# EasyEDA Pro project ProDoc_ATM触摸屏方案_2026-06-23.epro

# Schematic Schematic15
Board Name: Board1; Create Date: 2026-01-06; Page Name: P1; Project Name: 电容计量1; Schematic Name: Schematic5; Update Date: 2026-01-06; Page Size: A4; Version: V1.0
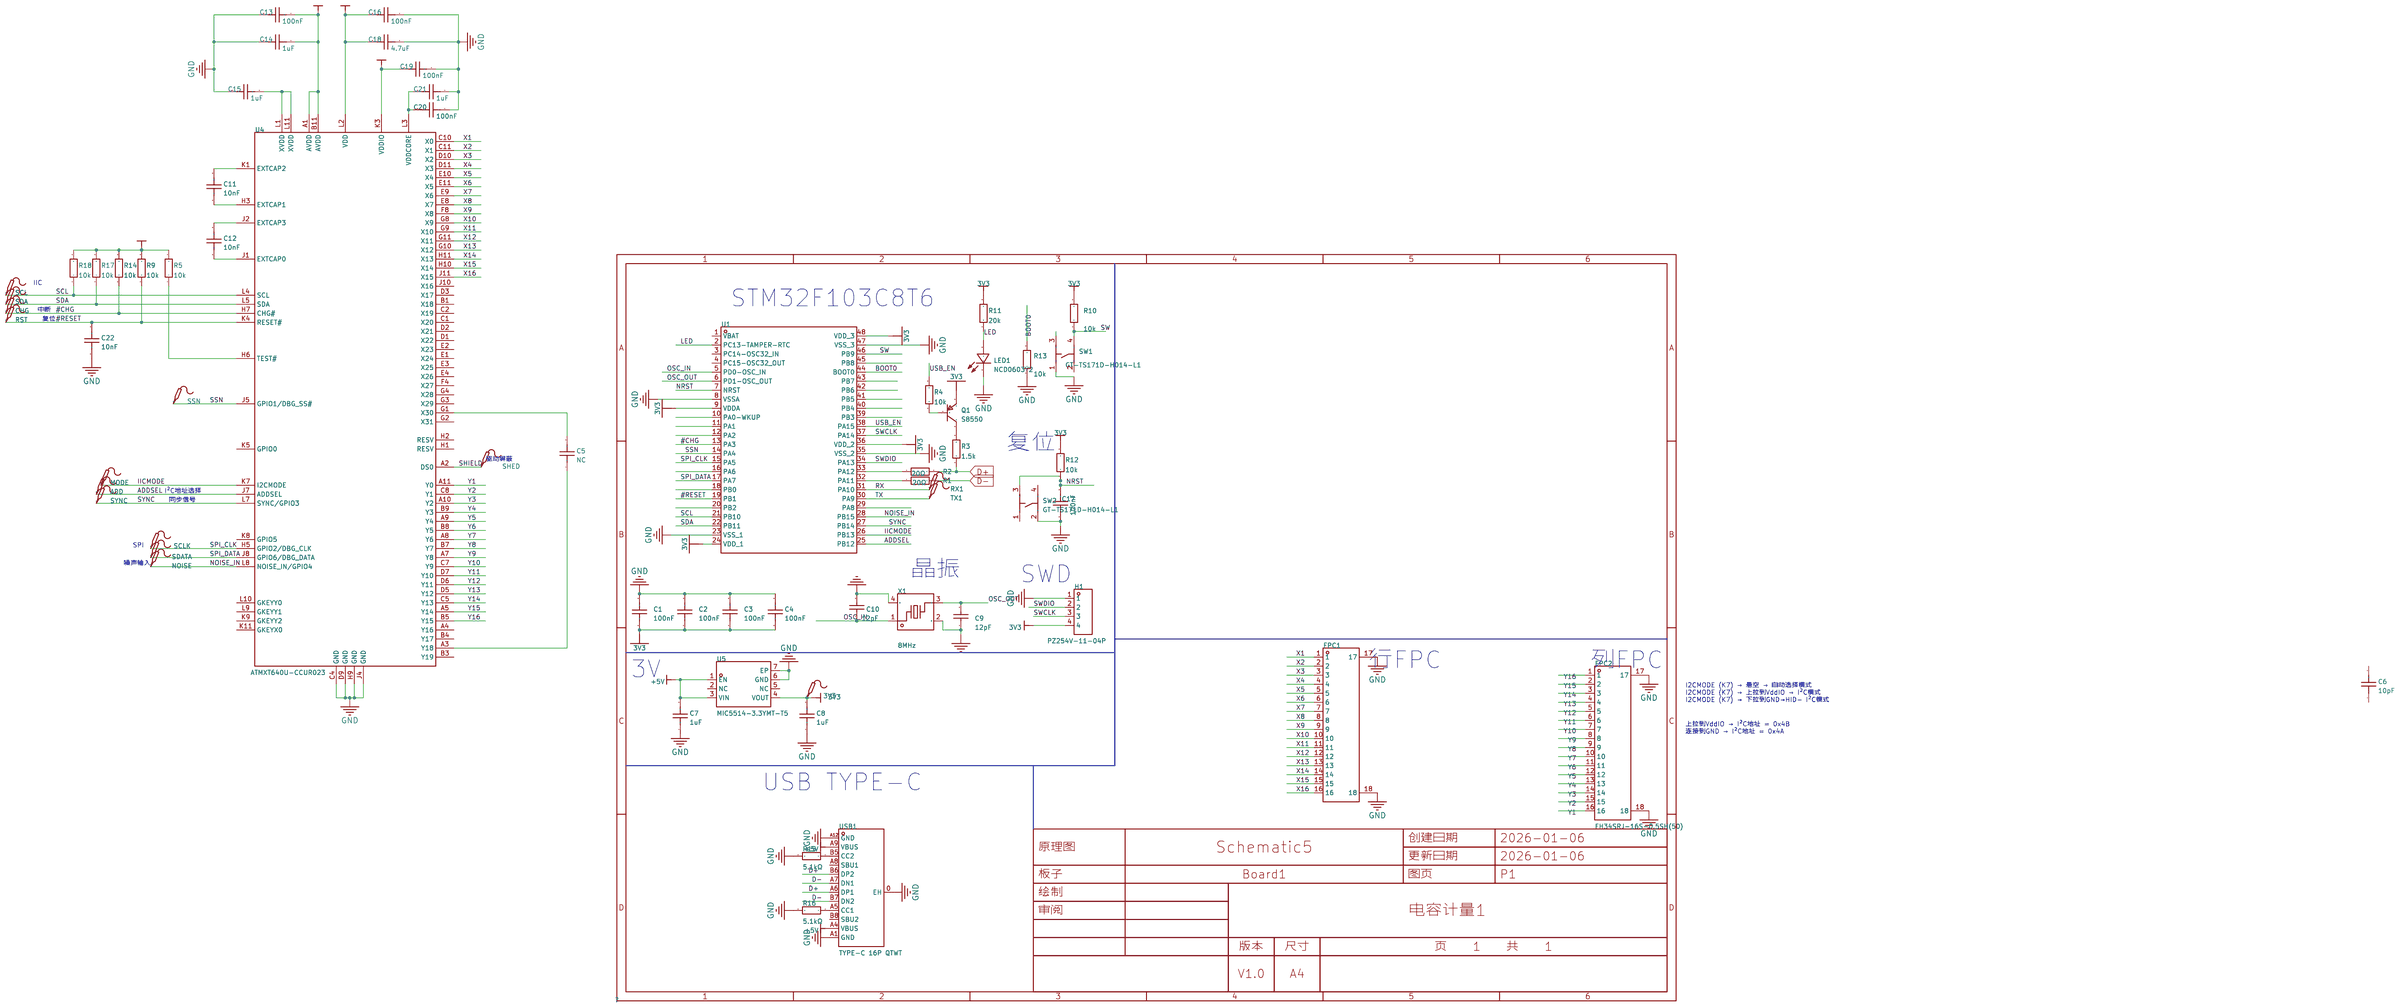
[diagram p0: schematic sheet]

## Parts
3V3  -  [Test-Point-0.5mm]
ADD  -  [Test-Point-0.5mm]
C1  100nF  [C0402]
C2  100nF  [C0402]
C3  100nF  [C0402]
C4  100nF  [C0402]
C5  NC  [C0402]
C6  10pF  [C0402]
C7  1uF  [C0402]
C8  1uF  [C0402]
C9  12pF  [C0402]
C10  12pF  [C0402]
C11  10nF  [C0402]
C12  10nF  [C0402]
C13  100nF  [C0402]
C14  1uF  [C0402]
C15  1uF  [C0402]
C16  100nF  [C0402]
C17  100nF  [C0402]
C18  4.7uF  [C0402]
C19  100nF  [C0402]
C20  100nF  [C0402]
C21  1uF  [C0402]
C22  10nF  [C0402]
CHG  -  [Test-Point-0.5mm]
FPC1  FH34SRJ-16S-0.5SH(50)  [FFC-SMD_16P-P0.50_FH34SRJ-16S-0.5SH]
FPC2  FH34SRJ-16S-0.5SH(50)  [FFC-SMD_16P-P0.50_FH34SRJ-16S-0.5SH]
H1  PZ254V-11-04P  [HDR-TH_4P-P2.54-V-M]
LED1  NCD0603Y2  [LED0603-RD]
MODE  -  [Test-Point-0.5mm]
NOISE  -  [Test-Point-0.5mm]
Q1  S8550  [SOT-23-3_L2.9-W1.3-P1.90-LS2.4-BR]
R1  20Ω  [R0402]
R2  20Ω  [R0402]
R3  1.5k  [R0402]
R4  10k  [R0402]
R5  10k  [R0402]
R9  10k  [R0402]
R10  10k  [R0402]
R11  20k  [R0402]
R12  10k  [R0402]
R13  10k  [R0402]
R14  10k  [R0402]
R15  5.1kΩ  [R0402]
R16  5.1kΩ  [R0402]
R17  10k  [R0402]
R18  10k  [R0402]
RST  -  [Test-Point-0.5mm]
RX1  -  [Test-Point-0.5mm]
SCL  -  [Test-Point-0.5mm]
SCLK  -  [Test-Point-0.5mm]
SDA  -  [Test-Point-0.5mm]
SDATA  -  [Test-Point-0.5mm]
SHED  -  [Test-Point-0.5mm]
SSN  -  [Test-Point-0.5mm]
SW1  GT-TS171D-H014-L1  [SW-SMD_4P-L3.0-W2.8-P1.65-TL_GT-TS171A-H014-L1]
SW2  GT-TS171D-H014-L1  [SW-SMD_4P-L3.0-W2.8-P1.65-TL_GT-TS171A-H014-L1]
SYNC  -  [Test-Point-0.5mm]
TX1  -  [Test-Point-0.5mm]
U1  -  [LQFP-48_L7.0-W7.0-P0.50-LS9.0-BL]
U4  ATMXT640U-CCUR023  [UFBGA-88_L6.0-W6.0-P0.50-TL_MICROCHIP_ATMXT640UXXX]
U5  MIC5514-3.3YMT-T5  [DFN-6_L1.6-W1.6-P0.50-BL-EP]
USB1  TYPE-C 16P QTWT  [USB-TYPE-C-SMD_TYPE-C-16P-QTWT]
X1  8MHz  [CRYSTAL-SMD_4P-L3.2-W2.5-BL-1]

## Library data of the parts
3V3 ADD CHG MODE NOISE RST RX1 SCL SCLK SDA SDATA SHED SSN SYNC TX1 = Test-Point: Test Point 测试点
C1-C8 C11-C16 C18-C22 = CC0402KRX7R7BB104: 容值:100nF;精度:±10%;额定电压:16V;温度系数:X7R;; LCSC Part Name: 100nF ±10% 16V; Supplier Part: C60474; Manufacturer: YAGEO(国巨); Supplier Footprint: 0402; JLCPCB Part Class: Extended Part; Datasheet: https://atta.szlcsc.com/upload/public/pdf/source/20211223/9278FD768280B81DDBEF48FA36411A03.pdf; Supplier: LCSC; Tolerance: ±10%; Voltage Rated: 16V; Temperature Coefficient: X7R
C9 C10 = GCM1555C1H120FA16D: 容值:12pF;精度:±1%;额定电压:50V;材质(温度系数):C0G;; LCSC Part Name: 12pF ±1% 50V; Supplier Part: C393682; Manufacturer: muRata(村田); Supplier Footprint: 0402; JLCPCB Part Class: Extended Part; Datasheet: https://atta.szlcsc.com/upload/public/pdf/source/20190516/C393682_2405B7553F1D74F0F214F12B2CF6E34B.pdf; Supplier: LCSC; Tolerance: ±1%; Voltage Rated: 50V; Temperature Coefficient: C0G
C17 = CC0603KRX7R9BB104: 容值:100nF;精度:±10%;额定电压:50V;材质(温度系数):X7R;; LCSC Part Name: 100nF ±10% 50V; Supplier Part: C14663; Manufacturer: YAGEO(国巨); Supplier Footprint: 0603; JLCPCB Part Class: Basic Part; Datasheet: https://atta.szlcsc.com/upload/public/pdf/source/20170116/1484561234239.pdf; Supplier: LCSC; Tolerance: ±10%; Voltage Rated: 50V; Temperature Coefficient: X7R
FPC1 FPC2 = FH34SRJ-16S-0.5SH(50): 锁定特性:-;触点类型:双侧触点/上下接;触点数量:16P;间距:0.5mm;安装方式:卧贴;工作温度:-55℃~+105℃;; LCSC Part Name: 间距:0.5mm P数:16P 双侧触点/上下接; Supplier Part: C324725; Manufacturer: HRS(广濑); Supplier Footprint: SMD,P=0.5mm,卧贴; JLCPCB Part Class: 扩展库; Datasheet: https://item.szlcsc.com/datasheet/FH34SRJ-16S-0.5SH(50)/305535.html; Supplier: LCSC; Contact Type: 双侧触点/上下接; Number of Contacts: 16P; Pitch: 0.5mm; Mounting Type: 卧贴; FFC, FCB Thickness: 0.3mm; Height Above Board: 1mm; Contact Material: 磷青铜; Contact Plating: 金; Operating Temperature: -55℃~+105℃
H1 = PZ254V-11-04P: 插针结构:1x4P;间距:2.54mm;行距:-;圆针/方针:方针;安装方式:直插;排数:单排;总PIN位数:4P;额定电流:3A;额定电压:250V;配合针长度:6mm;塑高:2.5mm;端接针长度:3mm;触头材质:-;工作温度:-40℃~+105℃;颜色:黑色;; LCSC Part Name: 1x4P 间距:2.54mm 方针 直插; Supplier Part: C2691448; Manufacturer: XFCN(兴飞); Supplier Footprint: 插件,P=2.54mm; JLCPCB Part Class: 扩展库; Datasheet: https://item.szlcsc.com/datasheet/PZ254V-11-04P/2801085.html; Supplier: LCSC; Pin Structure: 1x4P; Pitch: 2.54mm; Circluar Pins/Square Pins: 方针; Mounting Type: 直插; Number of Rows: 单排; Number of Pins: 4P; Current Rating: 3A; Voltage Rating (Max): 250V; Length of Mating Pin: 6mm; Insulation Height: 2.5mm; Length of End Connection Pin: 3mm; Operating Temperature: -40℃~+105℃; Color: 黑色
LED1 = NCD0603Y2: 发光颜色:黄色;正向电压(VF):1.6V~2.6V;功率:65mW;正向电流:20mA;主波长:586nm~595nm;透镜颜色:无色透明透镜;发光强度:100mcd~220mcd;发光角度:130°;工作温度:-30℃~+85℃;; Supplier Part: C89811; Manufacturer: 国星光电; Supplier Footprint: 0603; JLCPCB Part Class: Extended Part; Datasheet: https://atta.szlcsc.com/upload/public/pdf/source/20200820/C89811_7FE84B429B6BCA3E113B125EE1452576.pdf; Supplier: LCSC; Emitted Color: 黄色; Forward Voltage (VF): 1.6V~2.6V; Power Dissipation: 65mW; Forward Current: 20mA; Dominant Wavelength: 586nm~595nm; Lens Color: 无色透明透镜; Luminous Intensity: 100mcd~220mcd; Viewing Angle: 130°; Operating Temperature: -30℃~+85℃
Q1 = S8550: LCSC Part Name: PNP -25V -500mA 120-400 SOT-23; Supplier Part: C2931720; Manufacturer: Doeshare(德芯); Supplier Footprint: SOT-23; JLCPCB Part Class: 扩展库; Datasheet: https://atta.szlcsc.com/upload/public/pdf/source/20220104/15A23F6542E365B9E2BA018BE45092B6.pdf; Supplier: LCSC
R1 R2 = 0402WGJ0102TCE: 电阻类型:厚膜电阻;阻值:1kΩ;精度:±5%;功率:1/16W;温度系数:±100ppm/℃;最大工作电压:50V;工作温度范围:-55℃~+155℃;; LCSC Part Name: 1kΩ ±5%; Supplier Part: C25543; Manufacturer: UNI-ROYAL(厚声); Supplier Footprint: 0402; JLCPCB Part Class: Extended Part; Datasheet: https://atta.szlcsc.com/upload/public/pdf/source/20200306/C422600_1E6D84923E4A46A82E41ADD87F860B5C.pdf; Supplier: LCSC; Type: 厚膜电阻; Tolerance: ±5%; Power(Watts): 1/16W; Temperature Coefficient: ±100ppm/℃; Overload Voltage (Max): 50V; Operating Temperature Range: -55℃~+155℃
R3-R5 R9-R14 R17 R18 = 0603WAF1002T5E: LCSC Part Name: 10KΩ(1002) ±1% 编带; Supplier Part: C25804; Manufacturer: UNI-ROYAL(厚声); Supplier Footprint: 0603; JLCPCB Part Class: Basic Part; Datasheet: https://atta.szlcsc.com/upload/public/pdf/source/20170920/C25804_1505901551523983377.pdf; Supplier: LCSC
R15 R16 = 0805W8F5101T5E: 精度:±1%;温度系数:±100ppm/;阻值:5.1kΩ;功率:1/8W;最大工作电压:150V;工作温度范围:-55~+155;; LCSC Part Name: 5.1kΩ ±1%; Supplier Part: C27834; Manufacturer: UNI-ROYAL(厚声); Supplier Footprint: 0805; JLCPCB Part Class: 基础库; Datasheet: https://atta.szlcsc.com/upload/public/pdf/source/20170920/C27834_1505895234018981184.pdf; Supplier: LCSC; Tolerance: ±1%; Temperature Coefficient: ±100ppm/; Power(Watts): 1/8W; Overload Voltage (Max): 150V; Operating Temperature Range: -55~+155
SW1 SW2 = GT-TS171D-H014-L1: 电路结构:单刀单掷;按钮形状:圆形按钮;作用力:80gf;安装方式:立贴;开关长度:3mm;开关宽度:2.75mm;开关高度:1.4mm;带支架:不带支架;触点电流:50mA;额定电压:12V;带灯:无;工作寿命:10万次;; LCSC Part Name: 3*2.75*1.4mm 立贴 轻触开关; Supplier Part: C2762969; Manufacturer: G-Switch(品赞); Supplier Footprint: SMD; JLCPCB Part Class: Extended Part; Datasheet: https://item.szlcsc.com/datasheet/GT-TS171D-H014-L1/2892001.html; Supplier: LCSC; Circuit: 单刀单掷; Actuator Style: 圆形按钮; Operating Force: 80gf; Mounting Type: 立贴; Length: 3mm; Width: 2.75mm; Switch Height: 1.4mm; with Bracket: 不带支架; Contact Current: 50mA; Voltage Rating: 12V; Actuator/Cap Color: 白色; With Lamp: 无; Termination Style: SMD接片; Life: 10万次; Operating Temperature: -30℃~+85℃
U1 = STM32F103C8T6: 工作电压:2V ~ 3.6V;CPU位数:32-Bit;CPU内核:ARM- Cortex--M3;主频（MAX):72MHz;ROM类型:FLASH;; Supplier Part: C8734; Manufacturer: ST(意法半导体); Supplier Footprint: LQFP-48_7x7x05P; JLCPCB Part Class: Basic Part; Datasheet: https://atta.szlcsc.com/upload/public/pdf/source/20140724/1457707174202.pdf; Supplier: LCSC
U4 = ATMXT640U-CCUR023: 分辨率(位):-;接口类型:I2C；SPI;工作电压:3.3V;; Supplier Part: C1852722; Manufacturer: MICROCHIP(美国微芯); Supplier Footprint: UFBGA-88(6x6); JLCPCB Part Class: Extended Part; Datasheet: https://atta.szlcsc.com/upload/public/pdf/source/20230907/BF6398F5379D73FCE01FD5C05095E89D.pdf; Supplier: LCSC; Interface: I2C；SPI; Voltage - Supply: 3.3V; Operating Temperature: -40℃~+85℃
U5 = MIC5514-3.3YMT-T5: Supplier Part: C633175; Manufacturer: MICROCHIP(美国微芯); Supplier Footprint: DFN-6-EP(1.6x1.6); JLCPCB Part Class: Extended Part; Datasheet: https://item.szlcsc.com/datasheet/MIC5514-3.3YMT-T5/662840.html; Supplier: LCSC
USB1 = TYPE-C 16P QTWT: 连接器类型:Type-C;协议标准:USB 3.1;公母:母;安装方式:卧贴;触点数量:16P;端口数量:1;额定电流 - 电源:3A;工作温度:-25℃~+85℃;; LCSC Part Name: Type-C 母 卧贴; Supplier Part: C5187472; Manufacturer: SHOU HAN(首韩); Supplier Footprint: SMD; JLCPCB Part Class: Extended Part; Datasheet: https://item.szlcsc.com/datasheet/TYPE-C%252016P%2520QTWT/5860367.html; Supplier: LCSC; Connector Type: Type-C; Protocol Standard: USB 3.1; Gender: 母; Mounting Type: 卧贴; Number of Contacts: 16P; Number of Ports: 1; Current Rating-Power: 3A; Voltage Rating: 5V; Connect-Disconnect Life: 5千次; Detection color: 黑色; Operating Temperature: -25℃~+85℃
X1 = XL2EL89COI-111YLC-8M: 晶振类型:贴片晶振;频率:8MHz;常温频差:±10ppm;外接负载电容:12pF;频率稳定度(全温):±20ppm;; LCSC Part Name: 8MHz ±10ppm 12pF; Supplier Part: C2973805; Manufacturer: YXC(扬兴晶振); Supplier Footprint: SMD3225-4P; JLCPCB Part Class: 扩展库; Datasheet: https://atta.szlcsc.com/upload/public/pdf/source/20240329/19D5F850207469550BEB00D7DFEDBC7A.pdf; Supplier: LCSC; Crystal Type: 贴片晶振; Normal temperature Frequency Tolerance: ±10ppm; External load capacitor: 12pF; Frequency Stability(Full temperature range): ±20ppm; Equivalent Series Resistance (ESR): 150Ω; Operating Temperature: -40℃~+85℃

## Nets
3V3: 3V3.1 C1.1 C2.1 C3.1 C4.1 C8.2 C13.1 C14.1 C16.2 C18.2 C19.2 H1.4 Q1.2(E) R5.2 R9.2 R10.2 R11.2 R12.2 R14.2 R17.2 R18.2 U1.9(VDDA) U1.24(VDD_1) U1.36(VDD_2) U1.48(VDD_3) U4.A1(AVDD) U4.B11(AVDD) U4.K3(VDDIO) U4.L2(VDD) U5.4(VOUT)
+5V: C7.2 U5.1(EN) U5.3(VIN) USB1.A4(VBUS) USB1.A9(VBUS)
GND: C1.2 C2.2 C3.2 C4.2 C7.1 C8.1 C9.1 C10.2 C13.2 C14.2 C15.2 C16.1 C17.1 C18.1 C19.1 C20.1 C21.1 C22.1 FPC1.17 FPC1.18 FPC2.17 FPC2.18 H1.1 LED1.1(K) R13.1 R15.2 R16.2 SW1.1 SW2.2 U1.8(VSSA) U1.23(VSS_1) U1.35(VSS_2) U1.47(VSS_3) U4.C4(GND) U4.D9(GND) U4.H9(GND) U4.J4(GND) U5.6(GND) U5.7(EP) USB1.0(EH) USB1.A1(GND) USB1.A12(GND) X1.2(GND) X1.4(GND)
#CHG: CHG.1 R14.1 U1.13(PA3) U4.H7(CHG#)
#RESET: C22.2 R9.1 RST.1 U1.19(PB1) U4.K4(RESET#)
ADDSEL: ADD.1 U1.25(PB12) U4.J7(ADDSEL)
BOOT0: R13.2 U1.44(BOOT0)
D+: R2.2 R3.1 USB1.A6(DP1) USB1.B6(DP2)
D-: R1.2 USB1.A7(DN1) USB1.B7(DN2)
IICMODE: MODE.1 U1.26(PB13) U4.K7(I2CMODE)
LED: LED1.2(A) R11.1 U1.2(PC13-TAMPER-RTC)
NOISE_IN: NOISE.1 U1.28(PB15) U4.L8(NOISE_IN/GPIO4)
NRST: C17.2 R12.1 SW2.3 U1.7(NRST)
OSC_IN: C10.1 U1.5(PD0-OSC_IN) X1.1
OSC_OUT: C9.2 U1.6(PD1-OSC_OUT) X1.3
RX: RX1.1 U1.31(PA10)
SCL: R18.1 SCL.1 U1.21(PB10) U4.L4(SCL)
SDA: R17.1 SDA.1 U1.22(PB11) U4.L5(SDA)
SHIELD: SHED.1 U4.A2(DS0)
SPI_CLK: SCLK.1 U1.15(PA5) U4.H5(GPIO2/DBG_CLK)
SPI_DATA: SDATA.1 U1.17(PA7) U4.J8(GPIO6/DBG_DATA)
SSN: SSN.1 U1.14(PA4) U4.J5(GPIO1/DBG_SS#)
SW: R10.1 SW1.4 U1.46(PB9)
SWCLK: H1.3 U1.37(PA14)
SWDIO: H1.2 U1.34(PA13)
SYNC: SYNC.1 U1.27(PB14) U4.L7(SYNC/GPIO3)
TX: TX1.1 U1.30(PA9)
USB_EN: R4.2 U1.38(PA15)
X1: FPC1.1 U4.C10(X0)
X2: FPC1.2 U4.C11(X1)
X3: FPC1.3 U4.D10(X2)
X4: FPC1.4 U4.D11(X3)
X5: FPC1.5 U4.E10(X4)
X6: FPC1.6 U4.E11(X5)
X7: FPC1.7 U4.E9(X6)
X8: FPC1.8 U4.E8(X7)
X9: FPC1.9 U4.F8(X8)
X10: FPC1.10 U4.G8(X9)
X11: FPC1.11 U4.G9(X10)
X12: FPC1.12 U4.G11(X11)
X13: FPC1.13 U4.G10(X12)
X14: FPC1.14 U4.H11(X13)
X15: FPC1.15 U4.H10(X14)
X16: FPC1.16 U4.J11(X15)
Y1: FPC2.16 U4.A11(Y0)
Y2: FPC2.15 U4.C8(Y1)
Y3: FPC2.14 U4.A10(Y2)
Y4: FPC2.13 U4.B9(Y3)
Y5: FPC2.12 U4.A9(Y4)
Y6: FPC2.11 U4.B8(Y5)
Y7: FPC2.10 U4.A8(Y6)
Y8: FPC2.9 U4.B7(Y7)
Y9: FPC2.8 U4.A7(Y8)
Y10: FPC2.7 U4.C7(Y9)
Y11: FPC2.6 U4.D7(Y10)
Y12: FPC2.5 U4.D6(Y11)
Y13: FPC2.4 U4.D5(Y12)
Y14: FPC2.3 U4.C5(Y13)
Y15: FPC2.2 U4.A5(Y14)
Y16: FPC2.1 U4.B5(Y15)
$1N12: R16.1 USB1.A5(CC1)
$1N14: R15.1 USB1.B5(CC2)
$1N194: Q1.1(B) R4.1
$1N196: Q1.3(C) R3.2
$1N212: R2.1 U1.33(PA12)
$1N232: R1.1 U1.32(PA11)
$1N275: C12.2 U4.J2(EXTCAP3)
$1N276: C12.1 U4.J1(EXTCAP0)
$1N277: C11.1 U4.H3(EXTCAP1)
$1N278: C11.2 U4.K1(EXTCAP2)
$1N299: R5.1 U4.H6(TEST#)
$1N301: C15.1 U4.L1(XVDD) U4.L11(XVDD)
$1N305: C20.2 C21.2 U4.L3(VDDCORE)
$1N379: C5.1 U4.A3(Y18)
$1N380: C5.2 U4.G1(X30)

Not connected (* = marked no-connect by the designer): C6 1 2; SW1 2 3; SW2 1 4; U1 1(VBAT) 3(PC14-OSC32_IN) 4(PC15-OSC32_OUT) 10(PA0-WKUP) 11(PA1) 12(PA2) 16(PA6) 18(PB0) 20(PB2) 29(PA8) 39(PB3) 40(PB4) 41(PB5) 42(PB6) 43(PB7) 45(PB8); U4 A4(Y16) B1(X18) B3(Y19) B4(Y17) C1(X20) C2(X19) D1(X22) D2(X21) D3(X17) E1(X24) E2(X23) E3(X25) E4(X26) F4(X27) G2(X31) G3(X29) G4(X28) H1(RESV) H2(RESV) J10(X16) K5(GPIO0) K8(GPIO5) K9(GKEYY2) K11(GKEYX0) L9(GKEYY1) L10(GKEYY0); U5 2(NC) 5(NC); USB1 A8(SBU1) B8(SBU2)

## Notes on the sheet
- IIC
- STM32F103C8T6
- 中断
- 复位
- 复位
- 驱动屏蔽
- I²C地址选择
- 同步信号
- SPI
- 噪声输入
- 晶振
- SWD
- 行FPC
- 列FPC
- 3V
- I2CMODE (K7) → 悬空 → 自动选择模式
  I2CMODE (K7) → 上拉到VddIO → I²C模式
  I2CMODE (K7) → 下拉到GND→HID- I²C模式
- 上拉到VddIO → I²C地址 = 0x4B
  连接到GND → I²C地址 = 0x4A
- USB TYPE-C

# Board PCB15
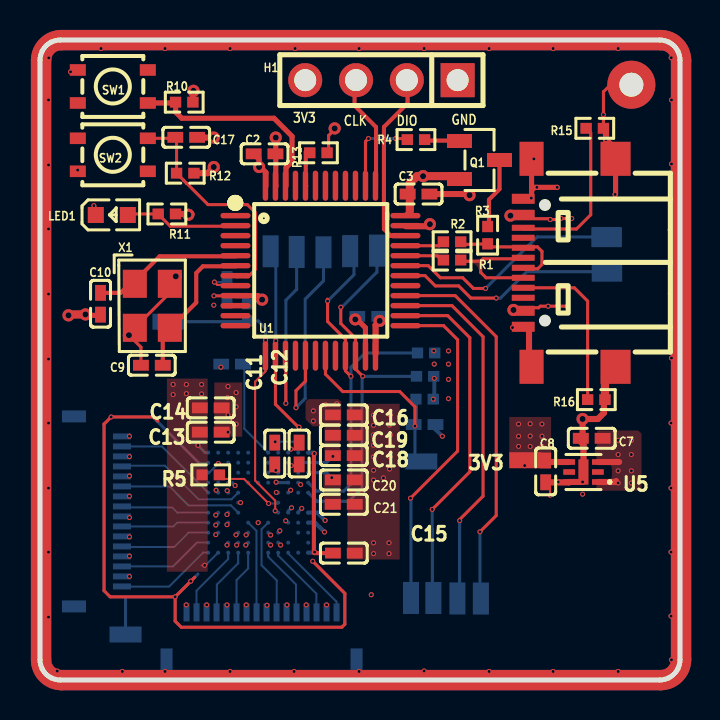
[diagram p1: board, top side]
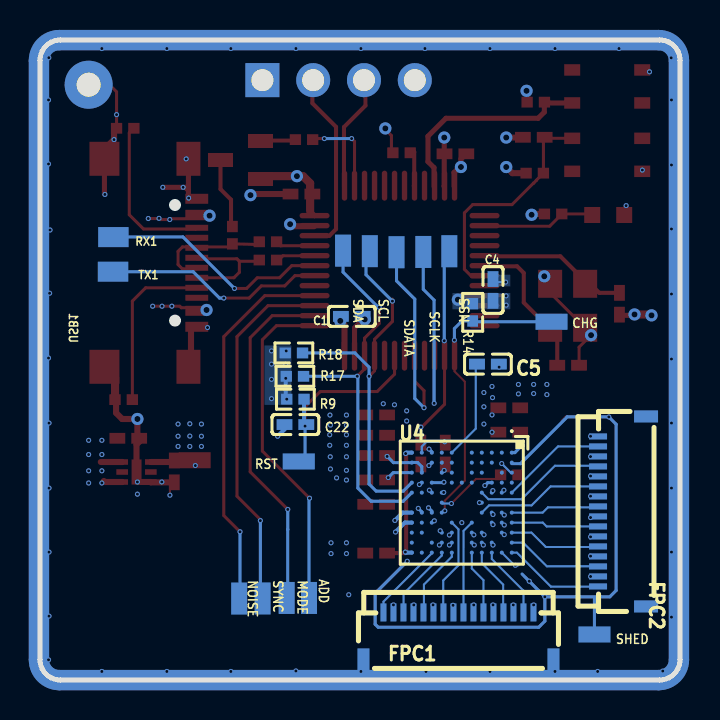
[diagram p2: board, bottom side, seen from below]

Outline 32 x 32 mm; copper layers: Top Layer, Inner1, Inner2, Bottom Layer. Coordinates in mm from the lower left corner of the outline.
Outline path: 0,30.98 0,1.02 arc(0.3,0.3) 1.02,0 30.98,0 arc(31.7,0.3) 32,1.02 32,30.98 arc(31.7,31.7) 30.98,32 1.02,32 arc(0.3,31.7) 0,30.98
Stack: Top Layer 0.035mm Outer layer thickness 1oz / Dielectric1 0.2104mm 7628 RC49% 8.6mil / Inner1 0.0152mm Inner layer thickness / Dielectric2 1.065mm 1.1mm H/HOZ Copper / Inner2 0.0152mm Inner layer thickness / Dielectric3 0.2104mm 7628 RC49% 8.6mil / Bottom Layer 0.035mm Outer layer thickness 1oz

## Design rules (mm)
spacing copperThickness1oz (default): track to track 0.102, other pairs 0 to 0.3
spacing copperThickness2oz: track to track 0.203, other pairs 0.152 to 0.3
spacing safeClearance1: track to track 0.152, other pairs 0.152 to 0.3
track width copperThickness1oz (default): min 0.051, default 0.254, max 2.54
track width copperThickness2oz: min 0.203, default 0.254, max 2.54
differential pair differentialPair (default): width min 0.127, default 0.254, max 2.54; gap min 0.152, default 0.152
net GND uses copperRegion

## Placement (name value [footprint] x y rotation side)
3V3  -  [Test-Point-0.5mm]  24.27 10.99 90 top
ADD  -  [Test-Point-0.5mm]  18.55 4.1 180 bottom
C1  100nF  [C0402]  16.41 18.18 180 bottom
C2  100nF  [C0402]  11.23 26.31 0 top
C3  100nF  [C0402]  18.93 24.3 0 top
C4  100nF  [C0402]  9.35 19.5 90 bottom
C5  NC  [C0402]  9.6 15.79 0 bottom
C7  1uF  [C0402]  27.59 12.09 0 top
C8  1uF  [C0402]  25.28 10.43 90 top
C9  12pF  [C0402]  5.59 15.74 0 top
C10  12pF  [C0402]  3.03 18.81 270 top
C11  10nF  [C0402]  11.74 11.32 90 top
C12  10nF  [C0402]  12.96 11.32 270 top
C13  100nF  [C0402]  8.54 12.39 0 top
C14  1uF  [C0402]  8.54 13.61 0 top
C15  1uF  [C0402]  15.19 6.34 0 top
C16  100nF  [C0402]  15.19 13.25 180 top
C17  100nF  [C0402]  7.31 27.13 180 top
C18  4.7uF  [C0402]  15.19 11.22 180 top
C19  100nF  [C0402]  15.19 12.24 180 top
C20  100nF  [C0402]  15.19 10 180 top
C21  1uF  [C0402]  15.19 8.78 180 top
C22  10nF  [C0402]  19.23 12.77 180 bottom
CHG  -  [Test-Point-0.5mm]  6.42 17.91 90 bottom
FPC1  FH34SRJ-16S-0.5SH(50)  [FFC-SMD_16P-P0.50_FH34SRJ-16S-0.5SH]  11.08 2.18 180 bottom
FPC2  FH34SRJ-16S-0.5SH(50)  [FFC-SMD_16P-P0.50_FH34SRJ-16S-0.5SH]  2.9 8.43 90 bottom
H1  PZ254V-11-04P  [HDR-TH_4P-P2.54-V-M]  17.07 29.99 180 top
LED1  NCD0603Y2  [LED0603-RD]  3.59 23.25 0 top
MODE  -  [Test-Point-0.5mm]  19.67 4.1 180 bottom
NOISE  -  [Test-Point-0.5mm]  22.04 4.07 180 bottom
NOREF  -  [Pad_e949]  29.57 29.76 0 top
Q1  S8550  [SOT-23-3_L2.9-W1.3-P1.90-LS2.4-BR]  21.97 26 180 top
R1  20Ω  [R0402]  20.6 21 0 top
R2  20Ω  [R0402]  20.6 21.91 0 top
R3  1.5k  [R0402]  22.38 22.24 90 top
R4  10k  [R0402]  18.8 27.02 180 top
R5  10k  [R0402]  8.54 10.26 180 top
R9  10k  [R0402]  19.23 14.04 0 bottom
R10  10k  [R0402]  7.21 28.89 0 top
R11  20k  [R0402]  6.34 23.3 0 top
R12  10k  [R0402]  7.26 25.34 0 top
R13  10k  [R0402]  13.92 26.36 180 top
R14  10k  [R0402]  10.37 18.38 90 bottom
R15  5.1kΩ  [R0402]  27.74 27.59 0 top
R16  5.1kΩ  [R0402]  27.81 14.02 0 top
R17  10k  [R0402]  19.26 15.18 0 bottom
R18  10k  [R0402]  19.31 16.35 0 bottom
RST  -  [Test-Point-0.5mm]  19.06 10.93 90 bottom
RX1  -  [Test-Point-0.5mm#2]  28.33 22.14 180 bottom
SCL  -  [Test-Point-0.5mm]  15.51 21.44 0 bottom
SCLK  -  [Test-Point-0.5mm]  12.83 21.4 0 bottom
SDA  -  [Test-Point-0.5mm]  16.85 21.47 0 bottom
SDATA  -  [Test-Point-0.5mm]  14.17 21.39 0 bottom
SHED  -  [Test-Point-0.5mm]  4.28 2.28 90 bottom
SSN  -  [Test-Point-0.5mm]  11.53 21.44 0 bottom
SW1  GT-TS171D-H014-L1  [SW-SMD_4P-L3.0-W2.8-P1.65-TL_GT-TS171A-H014-L1]  3.64 29.68 0 top
SW2  GT-TS171D-H014-L1  [SW-SMD_4P-L3.0-W2.8-P1.65-TL_GT-TS171A-H014-L1]  3.64 26.26 0 top
SYNC  -  [Test-Point-0.5mm]  20.87 4.08 180 bottom
TX1  -  [Test-Point-0.5mm#2]  28.35 20.41 180 bottom
U1  -  [LQFP-48_L7.0-W7.0-P0.50-LS9.0-BL]  14.02 20.47 270 top
U4  ATMXT640U-CCUR023  [UFBGA-88_L6.0-W6.0-P0.50-TL_MICROCHIP_ATMXT640UXXX]  10.91 8.87 270 bottom
U5  MIC5514-3.3YMT-T5  [DFN-6_L1.6-W1.6-P0.50-BL-EP]  27.17 10.4 90 top
USB1  TYPE-C 16P QTWT  [USB-TYPE-C-SMD_TYPE-C-16P-QTWT]  26.47 20.86 90 top
X1  8MHz  [CRYSTAL-SMD_4P-L3.2-W2.5-BL-1]  5.62 18.71 270 top

## Footprints (pads in the part's own frame, mm; a bottom-side part is the same pattern mirrored in y, then rotated)
C0402
  rect 0.79x0.54 smd: 1(-0.545,0) 2(0.545,0)
CRYSTAL-SMD_4P-L3.2-W2.5-BL-1
  rect 1.4x1.2 smd: 1(-1.1,-0.875) 2(1.1,-0.875) 3(1.1,0.875) 4(-1.1,0.875)
DFN-6_L1.6-W1.6-P0.50-BL-EP
  rect 0.28x0.585 smd: 1(-0.5,-0.718) 2(0,-0.718) 3(0.5,-0.718) 4(0.5,0.718) 5(0,0.718) 6(-0.5,0.718)
  rect 1.26x0.5 smd: 7(0,0)
FFC-SMD_16P-P0.50_FH34SRJ-16S-0.5SH
  rect 0.3x0.9 smd: 1(3.75,1.2) 2(3.25,1.2) 3(2.75,1.2) 4(2.25,1.2) 5(1.75,1.2) 6(1.25,1.2) 7(0.75,1.2) 8(0.25,1.2) 9(-0.25,1.2) 10(-0.75,1.2) 11(-1.25,1.2) 12(-1.75,1.2) 13(-2.25,1.2) 14(-2.75,1.2) 15(-3.25,1.2) 16(-3.75,1.2)
  rect 0.6x1.2 smd: 17(-4.75,-1.2) 18(4.75,-1.2)
HDR-TH_4P-P2.54-V-M
  rect 1.7x1.7 hole 1.1: 1(-3.81,0)
  round 1.7 hole 1.1: 2(-1.27,0) 3(1.27,0) 4(3.81,0)
LED0603-RD
  rect 0.8x0.8 smd: 1(-0.799,0) 2(0.799,0)
LQFP-48_L7.0-W7.0-P0.50-LS9.0-BL
  oval 0.269x1.501 smd: 1(-2.751,-4.25) 2(-2.251,-4.25) 3(-1.75,-4.25) 4(-1.25,-4.25) 5(-0.75,-4.25) 6(-0.249,-4.25) 7(0.249,-4.25) 8(0.75,-4.25) 9(1.25,-4.25) 10(1.75,-4.25) 11(2.251,-4.25) 12(2.751,-4.25) 25(2.751,4.25) 26(2.251,4.25) 27(1.75,4.25) 28(1.25,4.25) 29(0.75,4.25) 30(0.249,4.25) 31(-0.249,4.25) 32(-0.75,4.25) 33(-1.25,4.25) 34(-1.75,4.25) 35(-2.251,4.25) 36(-2.751,4.25)
  oval 1.501x0.269 smd: 13(4.25,-2.751) 14(4.25,-2.251) 15(4.25,-1.75) 16(4.25,-1.25) 17(4.25,-0.75) 18(4.25,-0.249) 19(4.25,0.249) 20(4.25,0.75) 21(4.25,1.25) 22(4.25,1.75) 23(4.25,2.251) 24(4.25,2.751) 37(-4.25,2.751) 38(-4.25,2.251) 39(-4.25,1.75) 40(-4.25,1.25) 41(-4.25,0.75) 42(-4.25,0.249) 43(-4.25,-0.249) 44(-4.25,-0.75) 45(-4.25,-1.25) 46(-4.25,-1.75) 47(-4.25,-2.251) 48(-4.25,-2.751)
Pad_e949
  round 2.4 hole 1.2: 1(0,0)
R0402
  rect 0.566x0.54 smd: 1(-0.433,0) 2(0.433,0)
SOT-23-3_L2.9-W1.3-P1.90-LS2.4-BR
  rect 1.25x0.7 smd: 1(1,-0.95) 2(1,0.95) 3(-1,0)
SW-SMD_4P-L3.0-W2.8-P1.65-TL_GT-TS171A-H014-L1
  rect 0.8x0.575 smd: 1(-1.75,0.825) 2(-1.75,-0.825) 3(1.75,0.825) 4(1.75,-0.825)
Test-Point-0.5mm
  rect 0.8x1.6 smd: 1(0,0)
Test-Point-0.5mm#2
  rect 1.524x1 smd: 1(0,0)
UFBGA-88_L6.0-W6.0-P0.50-TL_MICROCHIP_ATMXT640UXXX
  round 0.2 smd: A1(-2.5,2.5) A2(-2,2.5) A3(-1.5,2.5) A4(-1,2.5) A5(-0.5,2.5) A7(0.5,2.5) A8(1,2.5) A9(1.5,2.5) A10(2,2.5) A11(2.5,2.5) B1(-2.5,2) B3(-1.5,2) B4(-1,2) B5(-0.5,2) B7(0.5,2) B8(1,2) B9(1.5,2) B11(2.5,2) C1(-2.5,1.5) C2(-2,1.5) C4(-1,1.5) C5(-0.5,1.5) C7(0.5,1.5) C8(1,1.5) C10(2,1.5) C11(2.5,1.5) D1(-2.5,1) D2(-2,1) D3(-1.5,1) D5(-0.5,1) D6(0,1) D7(0.5,1) D9(1.5,1) D10(2,1) D11(2.5,1) E1(-2.5,0.5) E2(-2,0.5) E3(-1.5,0.5) E4(-1,0.5) E8(1,0.5) E9(1.5,0.5) E10(2,0.5) E11(2.5,0.5) F4(-1,0) F8(1,0) G1(-2.5,-0.5) G2(-2,-0.5) G3(-1.5,-0.5) G4(-1,-0.5) G8(1,-0.5) G9(1.5,-0.5) G10(2,-0.5) G11(2.5,-0.5) H1(-2.5,-1) H2(-2,-1) H3(-1.5,-1) H5(-0.5,-1) H6(0,-1) H7(0.5,-1) H9(1.5,-1) H10(2,-1) H11(2.5,-1) J1(-2.5,-1.5) J2(-2,-1.5) J4(-1,-1.5) J5(-0.5,-1.5) J7(0.5,-1.5) J8(1,-1.5) J10(2,-1.5) J11(2.5,-1.5) K1(-2.5,-2) K3(-1.5,-2) K4(-1,-2) K5(-0.5,-2) K7(0.5,-2) K8(1,-2) K9(1.5,-2) K11(2.5,-2) L1(-2.5,-2.5) L2(-2,-2.5) L3(-1.5,-2.5) L4(-1,-2.5) L5(-0.5,-2.5) L7(0.5,-2.5) L8(1,-2.5) L9(1.5,-2.5) L10(2,-2.5) L11(2.5,-2.5)
USB-TYPE-C-SMD_TYPE-C-16P-QTWT
  rect 1.7x1.2 smd: 0(-5.2,1.891) 0(5.2,1.891)
  rect 1.7x1.5 smd: 0(-5.2,-2.309) 0(5.2,-2.309)
  rect 0.5x1.14 smd: A1(-3.2,2.308) A4(-2.4,2.308) A9(2.4,2.308) A12(3.2,2.308)
  rect 0.3x1.14 smd: A5(-1.25,2.308) A6(-0.25,2.308) A7(0.25,2.308) A8(1.25,2.309) B5(1.75,2.308) B6(0.75,2.308) B7(-0.75,2.308) B8(-1.75,2.309)

## Nets
As in the schematic, except:
GND: C1.2 C2.2 C3.2 C4.2 C7.1 C8.1 C9.1 C10.2 C13.2 C14.2 C15.2 C16.1 C17.1 C18.1 C19.1 C20.1 C21.1 C22.1 FPC1.17 FPC1.18 FPC2.17 FPC2.18 H1.1 LED1.1 NOREF.1 R13.1 R15.2 R16.2 SW1.1 SW2.2 U1.8 U1.23 U1.35 U1.47 U4.C4 U4.D9 U4.H9 U4.J4 U5.6 U5.7 USB1.0 USB1.A1 USB1.A12 X1.2 X1.4

Pads without a net: SW1 2; SW2 1 4; U1 1 3 4; U4 A4 B1 B3 B4 C1 C2 D1 D2 D3 E1 E2 E3 E4 F4 G2 G3 G4 H1 H2 J10 K5 K8 K9 K11 L9 L10; U5 2 5; USB1 A8 B8

## Via types
v1: diameter 0.254, hole 0.152, Top Layer to Bottom Layer, 207 vias
v2: diameter 0.61, hole 0.305, Top Layer to Bottom Layer, 20 vias

## Routing (per net, layer and track width the routed paths; a pad name or vN(x,y) marks a point on that pad's centre or on a via; arc(x,y) is an arc through that point)
3V3: length 20.9
  Top Layer w0.152: 9.77,19.22 9.76,19.21 v1(8.7,19.21)
  Top Layer w0.254: 10.95,25.72 11.3,25.38 11.3,24.69 ; 10.95,25.72 v2(10.95,25.65) ; 10.95,25.72 10.95,26.04 C2.1 ; v2(11.11,19.02) 10.9,19.22 9.77,19.22 ; 24.18,10.87 24.23,10.82 v1(24.23,10.72) ; U1.36 18.28,23.22 18.49,23.43 ; 16.78,16.31 16.77,16.3
  Top Layer w0.305: v2(8.69,25.65) 8.38,25.34 R12.2 ; 7.62,29.28 7.64,29.28 R10.2 ; R11.2 7.56,23.3 7.57,23.31 ; v2(16.99,17.95) 16.78,17.75 16.78,16.31 ; 26.46,10.9 23.8,10.9
  Top Layer w0.406: 18.49,24.41 18.49,24.84 18.85,25.19 v2(19.15,25.19) 20.73,25.19 20.87,25.05 Q1.2 ; 18.49,24.41 18.49,23.44 ; 18.49,24.41 18.38,24.3
  Bottom Layer w0.102: U4.B11 8.28,5.74 8.08,5.74
  Bottom Layer w0.152: 13.38,10.88 13.38,10.88 13.12,10.88 12.91,10.67 U4.K3 ; v1(14.64,11.18) 14.64,11.18 14.33,10.87 U4.L2 ; U4.A1 8.26,11.37 v1(7.9,11.73)
  Bottom Layer w0.203: v1(19.71,15.08) 19.71,14.09 v1(19.66,14.04)
  vias: v1(6.66,14.78) v1(6.66,14.27) v1(7.32,14.78) v1(7.32,14.32) v1(8.08,14.78) v1(8.08,14.3) v1(8.23,5.74) v1(8.69,18.74) v1(13.67,13.46) v1(13.67,12.95) v1(14.28,13.76) v1(14.84,13.81) v1(19.69,16.45) v1(19.71,15.79) v1(20.42,16.45) v1(20.42,15.79) v1(20.42,15.03) v1(20.42,14.07) v1(23.93,12.8) v1(23.93,12.19) v1(23.93,11.68) v1(24.51,12.81) v1(24.51,12.2) v1(24.51,11.68) v1(25.1,12.8) v1(25.1,12.19) v1(25.1,11.68) v2(7.42,23.26) v2(7.67,29.46)
+5V: length 8
  Top Layer w0.152: v2(23.52,23.22) 23.67,23.06 25.47,23.06 v1(25.51,23.02) 25.99,23.02 v1(26.05,23.08) 26.06,23.07 v1(26.59,23.07) ; v1(26.37,18.69) v1(25.9,18.69) v1(25.41,18.69) 25.01,18.69 24.94,18.61 24.31,18.61 USB1.A4 23.71,18.46 v2(23.67,18.5)
  Top Layer w0.305: U5.1 28.75,9.9 28.81,9.95 ; U5.3 28.96,10.9
  vias: v1(28.91,11.98) v1(28.91,11.27) v1(28.91,10.46) v1(28.91,9.85) v1(29.57,11.98) v1(29.57,11.27) v1(29.57,10.46) v1(29.57,9.85)
GND: length 70.4
  Top Layer w0.102: v1(2.69,23.72) 2.79,23.62 LED1.1 ; 25.35,9.82 25.5,9.67 v1(25.5,9.24) ; U1.8 9.74,19.76 8.86,19.76 v1(8.72,19.9)
  Top Layer w0.152: v2(14.73,27.58) 14.73,27.53 14.43,27.22 14.43,26.41 14.41,26.39 ; R15.2 v1(28.17,28.27) 28.17,29.41 28.88,30.12 ; v2(4.45,17.24) 5.05,16.64 C9.1 ; X1.2 6.79,19.66 6.79,20.11 ; 6.79,20.11 6.49,19.81 ; 6.79,20.11 v2(6.79,20.19)
  Top Layer w0.254: v2(15.76,18.03) 15.86,17.94 15.94,17.94 16.27,17.61 U1.23 ; 24.58,24.48 24.58,24.11 v1(24.57,24.1) ; 24.58,24.48 24.73,24.63 v1(25.86,24.63) ; 24.58,24.48 USB1.0 ; v1(28.75,24.28) 28.78,24.3 USB1.0 ; v2(1.42,18.23) 2.99,18.23 C10.2 ; v2(11.79,27.12) 11.79,24.7 11.8,24.69
  Top Layer w0.305: 18.3,22.69 19.39,22.69 v2(19.5,22.79) ; 27.1,12.09 27.13,12.12 v2(27.13,13.05) 27.89,13.05 28.2,13.36 28.2,13.97 R16.2 ; v2(21.48,24.24) 21.42,24.3 C3.2 ; USB1.0 28.78,26.54 v1(28.3,27.02) 28.3,27.59 ; 26.46,9.9 26.47,9.89 ; C8.1 25.29,9.88 26.44,9.88 ; v2(8.69,27.12) 7.87,27.12 C17.1 ; USB1.0 24.45,15.79 24.45,17.53 24.32,17.66 USB1.A1 ; 26.46,9.9 v1(27.13,9.9) 27.18,9.95 27.18,10.39 U5.7 27.17,11.77 26.8,12.15
  Top Layer w0.406: USB1.0 28.25,15.13 R16.2 ; v2(1.42,18.23) 1.47,18.28 v2(2.27,18.28)
  Inner1 w0.152: v1(16.68,6.86) 16.53,7.01 13.62,7.01 13.16,7.46 v1(11.99,7.46) 11.23,8.22 10.93,8.22 ; v1(11.81,9.89) 11.24,9.89 10.77,10.36 ; v1(11.81,9.89) 11.81,9.87 11.01,9.08 10.93,9.08 ; v1(11.81,9.89) 12.28,9.89 12.8,10.41 13.36,10.41 13.51,10.56 16.6,10.56 v1(16.68,10.48) ; 10.93,8.22 10.76,8.22 v1(9.8,7.26) 9.64,7.1 9.2,7.1 8.95,6.85 6.56,6.85 ; 10.93,8.22 10.93,9.08 ; v1(9.76,9.72) 9.76,12.03 v1(9.4,12.39) ; v1(9.76,9.72) 10.19,9.72 10.83,9.08 10.93,9.08 ; v1(9.76,9.72) 9.61,9.72 9.43,9.9 7.22,9.9
  Bottom Layer w0.102: v1(8.72,19.9) 9.2,19.9 C4.2
  Bottom Layer w0.152: v1(11.81,9.89) 11.83,9.87 U4.J4 ; v1(9.76,9.72) 9.61,9.87 U4.C4 ; U4.D9 v1(9.8,7.26)
  Bottom Layer w0.203: C22.1 19.78,12.53 v1(20.12,12.19)
  vias: v1(0.44,31.11) v1(0.43,29) v1(0.43,25.75) v1(0.43,22.55) v1(0.43,19.3) v1(0.43,16.05) v1(0.43,12.85) v1(0.43,9.6) v1(0.43,6.4) v1(0.43,3.14) v1(0.86,0.45) v1(1.53,30.41) v1(1.88,25.5) v1(3.05,31.57) v1(4.12,0.43) v1(6.25,31.57) v1(6.25,0.43) v1(9.4,14.68) v1(9.37,14.12) v1(9.4,13.25) v1(9.5,31.57) v1(9.5,0.43) v1(9.81,14.37) v1(9.81,13.66) v1(9.81,12.8) v1(12.75,31.57) v1(12.7,0.43) v1(15.95,31.57) v1(15.95,0.43) v1(16.56,4.26) v1(16.68,13.25) v1(16.68,12.73) v1(16.68,12.26) v1(16.68,11.73) v1(16.68,11.16) v1(16.68,10) v1(16.68,6.32) v1(17.17,10.1) v1(17.45,6.86) v1(17.45,6.32) v1(17.5,13.25) v1(17.48,12.75) v1(17.51,12.26) v1(17.51,11.73) v1(17.49,11.16) v1(17.48,10.55) v1(19.2,31.57) v1(19.2,0.45) v1(22.46,31.57) v1(22.46,0.43) v1(23.62,17.62) v1(24.69,26.06) v1(24.84,24.63) v1(25.66,31.57) v1(25.66,0.43) v1(25.91,9.9) v1(27.13,9.29) v1(28.91,31.57) v1(28.91,0.43) v1(31.56,31.11) v1(31.5,22.5) v1(31.52,19.34) v1(31.55,12.85) v1(31.55,9.6) v1(31.55,6.4) v1(31.55,3.2) v1(31.57,29) v1(31.57,25.8) v1(31.57,16.1) v1(31.57,1.01)
#CHG: length 14.9
  Top Layer w0.102: v1(11.76,8.46) 11.76,8.97 10.76,9.97 10.76,14.92 11.27,15.43 U1.13
  Top Layer w0.152: U1.13 11.27,16.98 v1(11.28,16.99)
  Bottom Layer w0.102: v1(11.76,8.46) 11.82,8.46 U4.H7
  Bottom Layer w0.152: CHG.1 10.33,17.91 R14.1 ; v1(11.28,16.99) 11.28,17.57 10.9,17.95 10.42,17.95
#RESET: length 19.2
  Top Layer w0.152: v1(18.75,12.7) 18.75,13.66 17.99,14.42 15.14,14.42 14.27,15.29 U1.19
  Inner2 w0.203: v1(18.75,12.7) 18.75,10.71 17.58,9.55 13.72,9.55 13.49,9.77 v1(13.03,9.77)
  Bottom Layer w0.102: 18.75,12.71 C22.2
  Bottom Layer w0.152: 19.47,10.93 18.94,10.93 18.75,11.12 v1(18.75,12.7) ; U4.K4 12.93,9.87 v1(13.03,9.77)
  Bottom Layer w0.203: R9.1 18.8,12.75
ADDSEL: length 23.1
  Top Layer w0.152: v1(18.52,9.09) 20.88,11.45 20.88,17.01 20.18,17.72 U1.25
  Inner2 w0.152: v1(18.52,9.09) 13.05,9.09 v1(12.57,8.61)
  Bottom Layer w0.152: v1(12.57,8.61) 12.41,8.44 U4.J7 ; v1(18.52,9.09) 18.55,9.06 18.55,4.26
BOOT0: length 1.7
  Top Layer w0.203: 13.31,26.43 13.29,26.41 13.29,24.74 13.31,24.71
D+: length 6
  Top Layer w0.152: 24.16,20.56 24.88,20.56 25.1,20.77 25.1,21.43 24.87,21.66 22.53,21.66 R3.1 21.23,21.78 21.04,21.96
D-: length 6
  Top Layer w0.152: 22.03,20.94 22.15,21.06 24.16,21.06 ; 22.03,20.94 21.09,20.94 R1.2 ; 22.03,20.94 22.03,20.38 22.3,20.11 24.11,20.11 24.16,20.06
IICMODE: length 24.3
  Top Layer w0.152: U1.26 20.39,18.22 21.49,17.11 21.49,10.41 v1(19.61,8.53)
  Inner2 w0.152: v1(13.09,8.58) 19.56,8.58 v1(19.61,8.53)
  Bottom Layer w0.152: U4.K7 12.91,8.4 v1(13.09,8.58) ; 19.62,4.1 19.62,7.52 19.61,7.52 v1(19.61,8.53)
LED: length 5.7
  Top Layer w0.152: 9.8,22.69 6.51,22.69 5.91,23.3 R11.1 4.44,23.3 LED1.2
NOISE_IN: length 27.5
  Top Layer w0.152: v1(22,7.41) 22.81,8.22 22.81,17.17 20.76,19.22 U1.28
  Inner2 w0.203: v1(22,7.41) 21.99,7.4 v1(14.23,7.4)
  Bottom Layer w0.152: v1(22,7.41) 22,4.14 22,4.13
  Bottom Layer w0.203: U4.L8 13.76,7.87 v1(14.23,7.4)
NRST: length 12
  Top Layer w0.152: SW2.3 6.72,27.08 C17.2 6.83,27.07 R12.1 7.18,24.99 7.18,24.98 7.32,24.84 7.33,24.84 8.4,23.77 10.37,23.77 10.78,23.36 10.78,20.54 10.41,20.16 9.83,20.16 9.8,20.19
OSC_IN: length 7.4
  Top Layer w0.203: X1.1 4.49,19.81 4.03,19.36 3.08,19.36 ; 9.8,21.19 5.98,21.19 4.81,20.01 4.72,20.01
OSC_OUT: length 7.4
  Top Layer w0.203: 9.8,20.69 8.15,20.69 7.81,20.35 7.81,18.87 6.75,17.81 6.47,17.81 ; 6.49,17.61 6.14,17.26 C9.2
RX: length 11.6
  Top Layer w0.152: v1(22.28,19.58) 21.67,19.58 21.13,20.11 20.02,20.11 19.41,20.72 U1.31
  Bottom Layer w0.152: v1(22.28,19.58) 24.85,22.15 28.32,22.15 RX1.1
SCL: length 19.4
  Top Layer w0.152: v1(15.55,15.18) 15.27,15.46 U1.21 15.27,17.03 14.38,17.93 14.38,19.05
  Bottom Layer w0.152: R18.1 16.26,16.35 15.55,15.64 v1(15.55,15.18) 15.55,9.8 15.19,9.44 13.83,9.44 U4.L4 ; SCL.1 15.7,21.25 15.7,20.26 v1(14.38,18.94)
SDA: length 19
  Top Layer w0.152: v1(16.14,15.19) 15.77,15.55 U1.22 15.77,17.09 15.04,17.83 v1(15.04,18.64)
  Bottom Layer w0.152: R17.1 16.14,15.18 v1(16.14,15.19) 16.11,15.16 16.11,9.6 15.45,8.94 13.84,8.94 U4.L5 ; v1(15.04,18.64) 15.09,18.64 16.85,20.4 SDA.1
SHIELD: length 99.1
  Top Layer w0.152: 5.89,12.95 5.69,13.15 v1(3.56,13.15) 3.2,12.8 3.2,4.47 3.51,4.16 v1(6.76,4.16) ; 7.74,5.14 v1(7.54,4.94) v1(6.76,4.16) ; v1(6.76,4.16) 6.76,2.94 7.06,2.64 15.09,2.64 15.24,2.79 15.24,4.33 v1(13.64,5.94)
  Inner1 w0.152: v1(6.76,4.16) 3.51,4.16 3.2,4.47 3.2,12.8 3.58,13.18 5.69,13.18 7.95,10.92 8.38,10.92 ; v1(6.76,4.16) v1(7.54,4.94) 7.86,5.27 ; v1(6.76,4.16) 6.76,2.94 7.06,2.64 15.09,2.64 15.24,2.79 15.24,4.33 v1(13.64,5.94)
  Bottom Layer w0.152: 4.28,2.23 4.28,4.08 ; v1(6.76,4.16) 6.76,2.94 7.06,2.64 15.09,2.64 15.24,2.79 15.24,4.33 v1(13.64,5.94) ; v1(6.76,4.16) 7.9,5.3 ; v1(6.76,4.16) 3.51,4.16 3.19,4.48 3.19,12.79 3.56,13.16 5.63,13.16 7.98,10.82 8.41,10.82
SPI_CLK: length 15.2
  Top Layer w0.152: U1.15 12.29,16.2 v1(12.29,13.83)
  Inner2 w0.152: v1(12.29,13.83) 11.38,12.92 11.38,9.81 v1(11.81,9.38)
  Bottom Layer w0.152: v1(12.29,13.83) 12.3,13.84 12.3,18.99 12.83,19.53 SCLK.1 ; v1(11.81,9.38) 11.79,9.38 11.78,9.36
SPI_DATA: length 17.3
  Top Layer w0.152: v1(12.8,13.61) 12.8,14.47 13.27,14.94 U1.17
  Inner2 w0.152: v1(12.8,13.61) 12.8,13.5 12.17,12.87 12.17,8.07 v1(12.28,7.96)
  Bottom Layer w0.152: v1(12.8,13.61) 13.26,14.08 13.26,19.05 14.17,19.96 SDATA.1 ; U4.J8 12.32,7.96 v1(12.28,7.96)
SSN: length 12.9
  Top Layer w0.152: v1(11.79,16.96) 11.77,16.95 U1.14 11.77,13.78 12.91,12.64 v1(12.96,12.64)
  Inner2 w0.152: v1(12.53,9.49) 12.56,9.49 12.63,9.56 12.63,10.14 12.95,10.45 12.95,12.64 v1(12.96,12.64)
  Bottom Layer w0.152: 12.41,9.37 v1(12.53,9.49) ; v1(11.79,16.96) 11.79,21.18 SSN.1
SW: length 10.8
  Top Layer w0.254: 12.3,24.69 12.3,25.62 12.6,25.92 12.6,27.18 11.7,28.09 7.09,28.09 6.78,28.39 6.78,28.89 R10.1 6.74,28.85 SW1.4
SWCLK: length 5.8
  Top Layer w0.203: 16.8,24.69 16.8,27.65 15.73,28.72 15.73,29.92 H1.3
SWDIO: length 9.2
  Top Layer w0.203: 18.38,22.21 17.53,22.21 17.2,22.54 17.2,27.66 18.38,28.84 18.38,29.86 18.44,29.86
SYNC: length 25.8
  Top Layer w0.152: v1(20.98,7.97) 20.98,8.02 22.15,9.19 22.15,17.17 20.6,18.72 U1.27
  Inner2 w0.203: v1(14.26,7.98) 14.26,7.97 v1(20.98,7.97)
  Bottom Layer w0.152: v1(20.98,7.97) 20.98,4.29 20.82,4.13
  Bottom Layer w0.203: v1(14.26,7.98) 13.87,8.37 U4.L7
TX: length 11.1
  Top Layer w0.152: v1(22.81,19.1) 21.54,19.1 20.93,19.71 19.76,19.71 19.25,20.22 U1.30
  Bottom Layer w0.152: TX1.1 24.34,20.41 23.02,19.1 v1(22.81,19.1)
USB_EN: length 4.7
  Top Layer w0.152: U1.38 16.27,26.92 v1(16.42,27.07) ; v1(17.78,27.07) 18.31,27.07 18.57,26.82
  Bottom Layer w0.152: v1(16.42,27.07) v1(17.78,27.07)
X1: length 3.8
  Inner2 w0.102: v1(7.32,3.75) 7.32,4.21 9.3,6.19 9.3,6.69 9.35,6.74
  vias: v1(9.35,6.75)
X2: length 3.6
  Bottom Layer w0.102: U4.C11 9.41,6.05 7.83,4.47 7.83,3.38
X3: length 3.6
  Inner2 w0.102: v1(9.83,6.75) 9.7,6.62 9.7,6.04 8.33,4.67 v1(8.33,3.75)
X4: length 3.4
  Bottom Layer w0.102: FPC1.4 8.84,3.39 8.84,4.77 9.91,5.84 U4.D11
X5: length 3.4
  Inner2 w0.102: v1(9.35,3.75) 9.35,5.13 10.21,5.99 10.21,6.67 v1(10.29,6.75)
X6: length 3.2
  Bottom Layer w0.102: U4.E11 10.41,5.58 9.83,4.99 FPC1.6
X7: length 3.8
  Inner2 w0.102: v1(10.31,3.75) 10.31,5.48 10.62,5.79 10.62,6.94 v1(10.31,7.26)
X8: length 4.7
  Bottom Layer w0.102: U4.E8 10.82,7.46 FPC1.8
X9: length 4.3
  Inner2 w0.102: v1(11.35,3.74) 11.35,5.36 10.92,5.79 10.92,7.85 v1(10.91,7.87)
X10: length 5.2
  Bottom Layer w0.102: U4.G8 11.08,7.54 11.08,5.74 11.84,4.97 11.84,3.16
X11: length 4.1
  Inner2 w0.102: 11.56,7.24 11.4,7.08 11.39,7.08 11.2,6.88 11.2,6.07 12.35,4.92 v1(12.35,3.75)
  vias: v1(11.53,7.25)
X12: length 3.4
  Bottom Layer w0.102: U4.G11 11.41,6.16 12.8,4.77 12.8,3.59
X13: length 3.7
  Inner2 w0.102: v1(13.31,3.75) 13.31,4.57 11.53,6.35 v1(11.53,6.75)
X14: length 4
  Bottom Layer w0.102: U4.H11 11.91,6.22 13.82,4.31 13.82,3.18
X15: length 3.9
  Inner2 w0.102: v1(12.03,6.75) 12.03,6.41 14.33,4.11 v1(14.33,3.75)
X16: length 4
  Bottom Layer w0.102: U4.J11 12.41,6.33 14.83,3.92 FPC1.16
Y1: length 5.4
  Bottom Layer w0.102: U4.A11 8.15,6.37 6.45,4.67 3.73,4.67
Y2: length 6.2
  Inner2 w0.102: v1(9.35,7.77) 9.35,7.26 8.74,6.65 8.03,6.65 6.56,5.18 v1(4.47,5.18)
Y3: length 5.2
  Bottom Layer w0.102: U4.A10 7.84,6.87 6.66,5.68 3.75,5.68
Y4: length 4.9
  Inner2 w0.102: v1(4.47,6.19) 6.66,6.19 7.57,7.11 8.63,7.11 v1(8.79,7.27)
  Bottom Layer w0.102: U4.B9 8.89,7.37 v1(8.79,7.27)
Y5: length 5
  Bottom Layer w0.102: U4.A9 7.43,7.37 6.71,6.65 3.71,6.65
Y6: length 4.6
  Inner2 w0.102: v1(4.47,7.16) 6.66,7.16 7.11,7.62 8.66,7.62 v1(8.79,7.75)
Y7: length 4.4
  Bottom Layer w0.102: U4.A8 6.86,7.87 6.67,7.68 FPC2.10
Y8: length 4.4
  Inner2 w0.102: 8.79,8.27 8.64,8.12 v1(4.47,8.12)
  vias: v1(8.79,8.25)
Y9: length 4
  Bottom Layer w0.102: 4.5,8.63 6.61,8.63 6.87,8.37 U4.A7
Y10: length 5.3
  Inner2 w0.102: v1(4.47,9.19) 6.5,9.19 7.12,8.58 9.05,8.58 v1(9.35,8.28)
Y11: length 6.4
  Bottom Layer w0.102: FPC2.6 6.47,9.68 7.42,8.73 9.55,8.73 U4.D7
Y12: length 6.2
  Inner2 w0.102: v1(10.03,8.87) 10.01,8.89 7.57,8.89 6.26,10.2 v1(4.47,10.2)
  Bottom Layer w0.102: U4.D6 v1(10.03,8.87)
Y13: length 6.3
  Bottom Layer w0.102: U4.D5 9.58,9.04 7.93,9.04 6.25,10.71 4.42,10.71
Y14: length 5.8
  Inner2 w0.102: v1(4.47,11.17) 6.15,11.17 8.16,9.16 9.05,9.16 v1(9.36,9.47)
Y15: length 4.9
  Bottom Layer w0.102: U4.A5 6.1,11.68 4.45,11.68
Y16: length 5.6
  Inner2 w0.102: v1(4.47,12.19) 6.11,12.19 v1(8.81,9.49)
  Bottom Layer w0.102: v1(8.81,9.49) 8.91,9.39 U4.B5
$1N12: length 8.4
  Top Layer w0.152: USB1.A5 26.72,19.61 27.38,18.95 R16.1
$1N14: length 8.1
  Top Layer w0.152: USB1.B5 24.22,22.55 26.82,22.55 27.54,23.26 27.54,27.36 R15.1
$1N194: length 2
  Top Layer w0.203: Q1.1 21.01,26.95 21.03,26.97 19.2,26.97 19.2,26.99 R4.1
$1N196: length 3.6
  Top Layer w0.203: Q1.3 22.97,24.54 22.45,24.02 22.45,22.74 R3.2
$1N212: length 1.9
  Top Layer w0.152: R2.1 19.97,21.71 18.38,21.71
$1N232: length 2
  Top Layer w0.152: 20.17,20.84 20.17,20.9 19.85,21.21 18.38,21.21
$1N275: length 0.6
  Top Layer w0.102: 12.96,10.68 12.91,10.72 v1(12.55,10.72)
  Bottom Layer w0.152: v1(12.55,10.72) 12.41,10.87 U4.J2
$1N276: length 0.7
  Top Layer w0.102: 12.96,11.77 12.73,11.54 v1(12.55,11.54)
  Bottom Layer w0.152: U4.J1 12.41,11.4 v1(12.55,11.54)
$1N277: length 0.2
  Bottom Layer w0.152: U4.H3 11.9,10.37 v1(11.79,10.48)
$1N278: length 1.6
  Bottom Layer w0.102: U4.K1 12.91,11.67 12.67,11.91 v1(11.76,11.91)
$1N299: length 3.6
  Top Layer w0.102: R5.1 9.17,10.05 10.2,10.05 v1(11.43,8.82)
  Bottom Layer w0.102: v1(11.43,8.82) 11.86,8.82 11.91,8.87
$1N301: length 6.6
  Top Layer w0.102: 13.72,6.34 13.73,6.36
  Top Layer w0.203: 14.65,6.4 14.6,6.34 13.72,6.34 13.69,6.37 13.69,11.3 v1(13.72,11.32)
  Bottom Layer w0.203: U4.L1 13.67,11.37 v1(13.72,11.32) ; v1(13.73,6.4) 13.7,6.37 U4.L11
$1N305: length 1.3
  Bottom Layer w0.152: v1(14.59,10.12) 14.34,10.37 U4.L3
$1N379: length 5.7
  Inner2 w0.102: v1(8.91,10.82) 9.04,10.95 v1(9.04,15.64) 8.94,15.75
  Bottom Layer w0.102: U4.A3 8.46,10.37 v1(8.91,10.82)
$1N380: length 4.8
  Bottom Layer w0.102: U4.G1 10.21,12.57 10.21,15.68

## Copper pours and planes (outline as drawn; the poured copper is in the pictures)
3V3 on Top Layer: 6.34,15.07 8.38,15.07 8.38,5.42 6.34,5.42
3V3 on Top Layer: 13.28,14.04 15.06,14.04 15.06,12.68 13.28,12.68
3V3 on Top Layer: 23.47,13.15 25.55,13.15 25.55,10.84 23.47,10.84
3V3 on Top Layer: 14.23,13.91 15.01,13.91 15.01,10.95 14.23,10.95
3V3 on Bottom Layer: 8.49,19.35 11.38,19.35 11.38,18.54 8.49,18.54
3V3 on Bottom Layer: 19.43,16.72 20.78,16.72 20.78,13.76 19.43,13.76
3V3 on Inner2: 7.09,12.67 5.07,14.69 5.07,31.08 13.77,31.08 14.63,30.22 14.63,29.05 20.71,29.05 21.64,28.12 21.34,18.32 23.57,16.4 25.66,14.32 25.66,10.61 25.61,10.66 23.17,10.66 23.17,11.68 22.14,12.67
+5V on Top Layer: 27.88,12.37 29.88,12.37 29.96,12.29 29.97,12.29 29.97,9.56 27.62,9.56 27.59,9.6 27.59,10.1 28.28,10.1 28.31,10.13 28.31,10.61 28.2,10.71 27.64,10.71 27.59,10.76 27.59,11.22 27.79,11.42 27.79,12.28
+5V on Inner2: 28.05,9.71 28.05,15.16 25.66,17.55 23.28,17.55 22.88,17.95 22.88,23.18 23.37,23.67 29.06,23.67 30.03,22.7 30.03,9.6 29.87,9.44 28.32,9.44
GND on Top Layer: 8.72,14.88 10.11,14.88 10.11,12.17 8.72,12.17
GND on Top Layer: -10.31,34.29 38.97,34.29 38.97,-4.73 -10.31,-4.73
GND on Top Layer: 15.37,13.81 17.99,13.81 17.99,6.02 15.37,6.02
GND on Bottom Layer: -7.41,32.91 35.82,32.91 35.82,-2.29 -7.41,-2.29
GND on Inner1: 25.86,13.61 27.59,13.61 27.59,9.05 25.86,9.05
GND on Inner1: 8.72,14.88 10.11,14.88 10.11,12.17 8.72,12.17
GND on Inner1: 23.67,25.04 26.57,25.04 26.57,24.33 23.67,24.33
GND on Inner1: 23.57,28.04 29.76,28.04 29.76,25.1 23.57,25.1
GND on Inner1: -1.67,-0.67 -1.67,32.71 32.41,32.71 32.41,-0.67
$1N305 on Top Layer: 14.17,10.3 15.04,10.3 15.04,8.51 14.17,8.51

Small or netless copper shapes (teardrops, artwork), in the pictures only: 1 on Top Layer, 1 on Bottom Layer

## Text on the board
Top Silkscreen Layer: 3V3 | CLK | DIO | GND
